# EasyEDA Pro project LY-5X-V3.1 - (0905).eprj, schematic 4轴-原理图-V01
Board Name: 4轴PCB; Create Date: 2024-07-26; Page Name: 4轴-原理图-V01; Project Name: LY-5X-V3.1 - (0905); Schematic Name: 4轴-原理图-V01; Update Date: 2025-12-03; Address1: *; Address2: *; Address3: *; Address4: *; ApprovedBy: *; Author: *; CheckedBy: *; CompanyName: *; CurrentDate: *; CurrentTime: *; Date: *; DocumentFullPathAndName: *; DocumentName: *; DocumentNumber: *; DrawnBy: *; Engineer: *; ImagePath: *; ModifiedDate: *; Organization: *; ProjectName: *; Revision: *; Rule: *; SheetNumber: *; SheetTotal: *; Time: *; Title: *
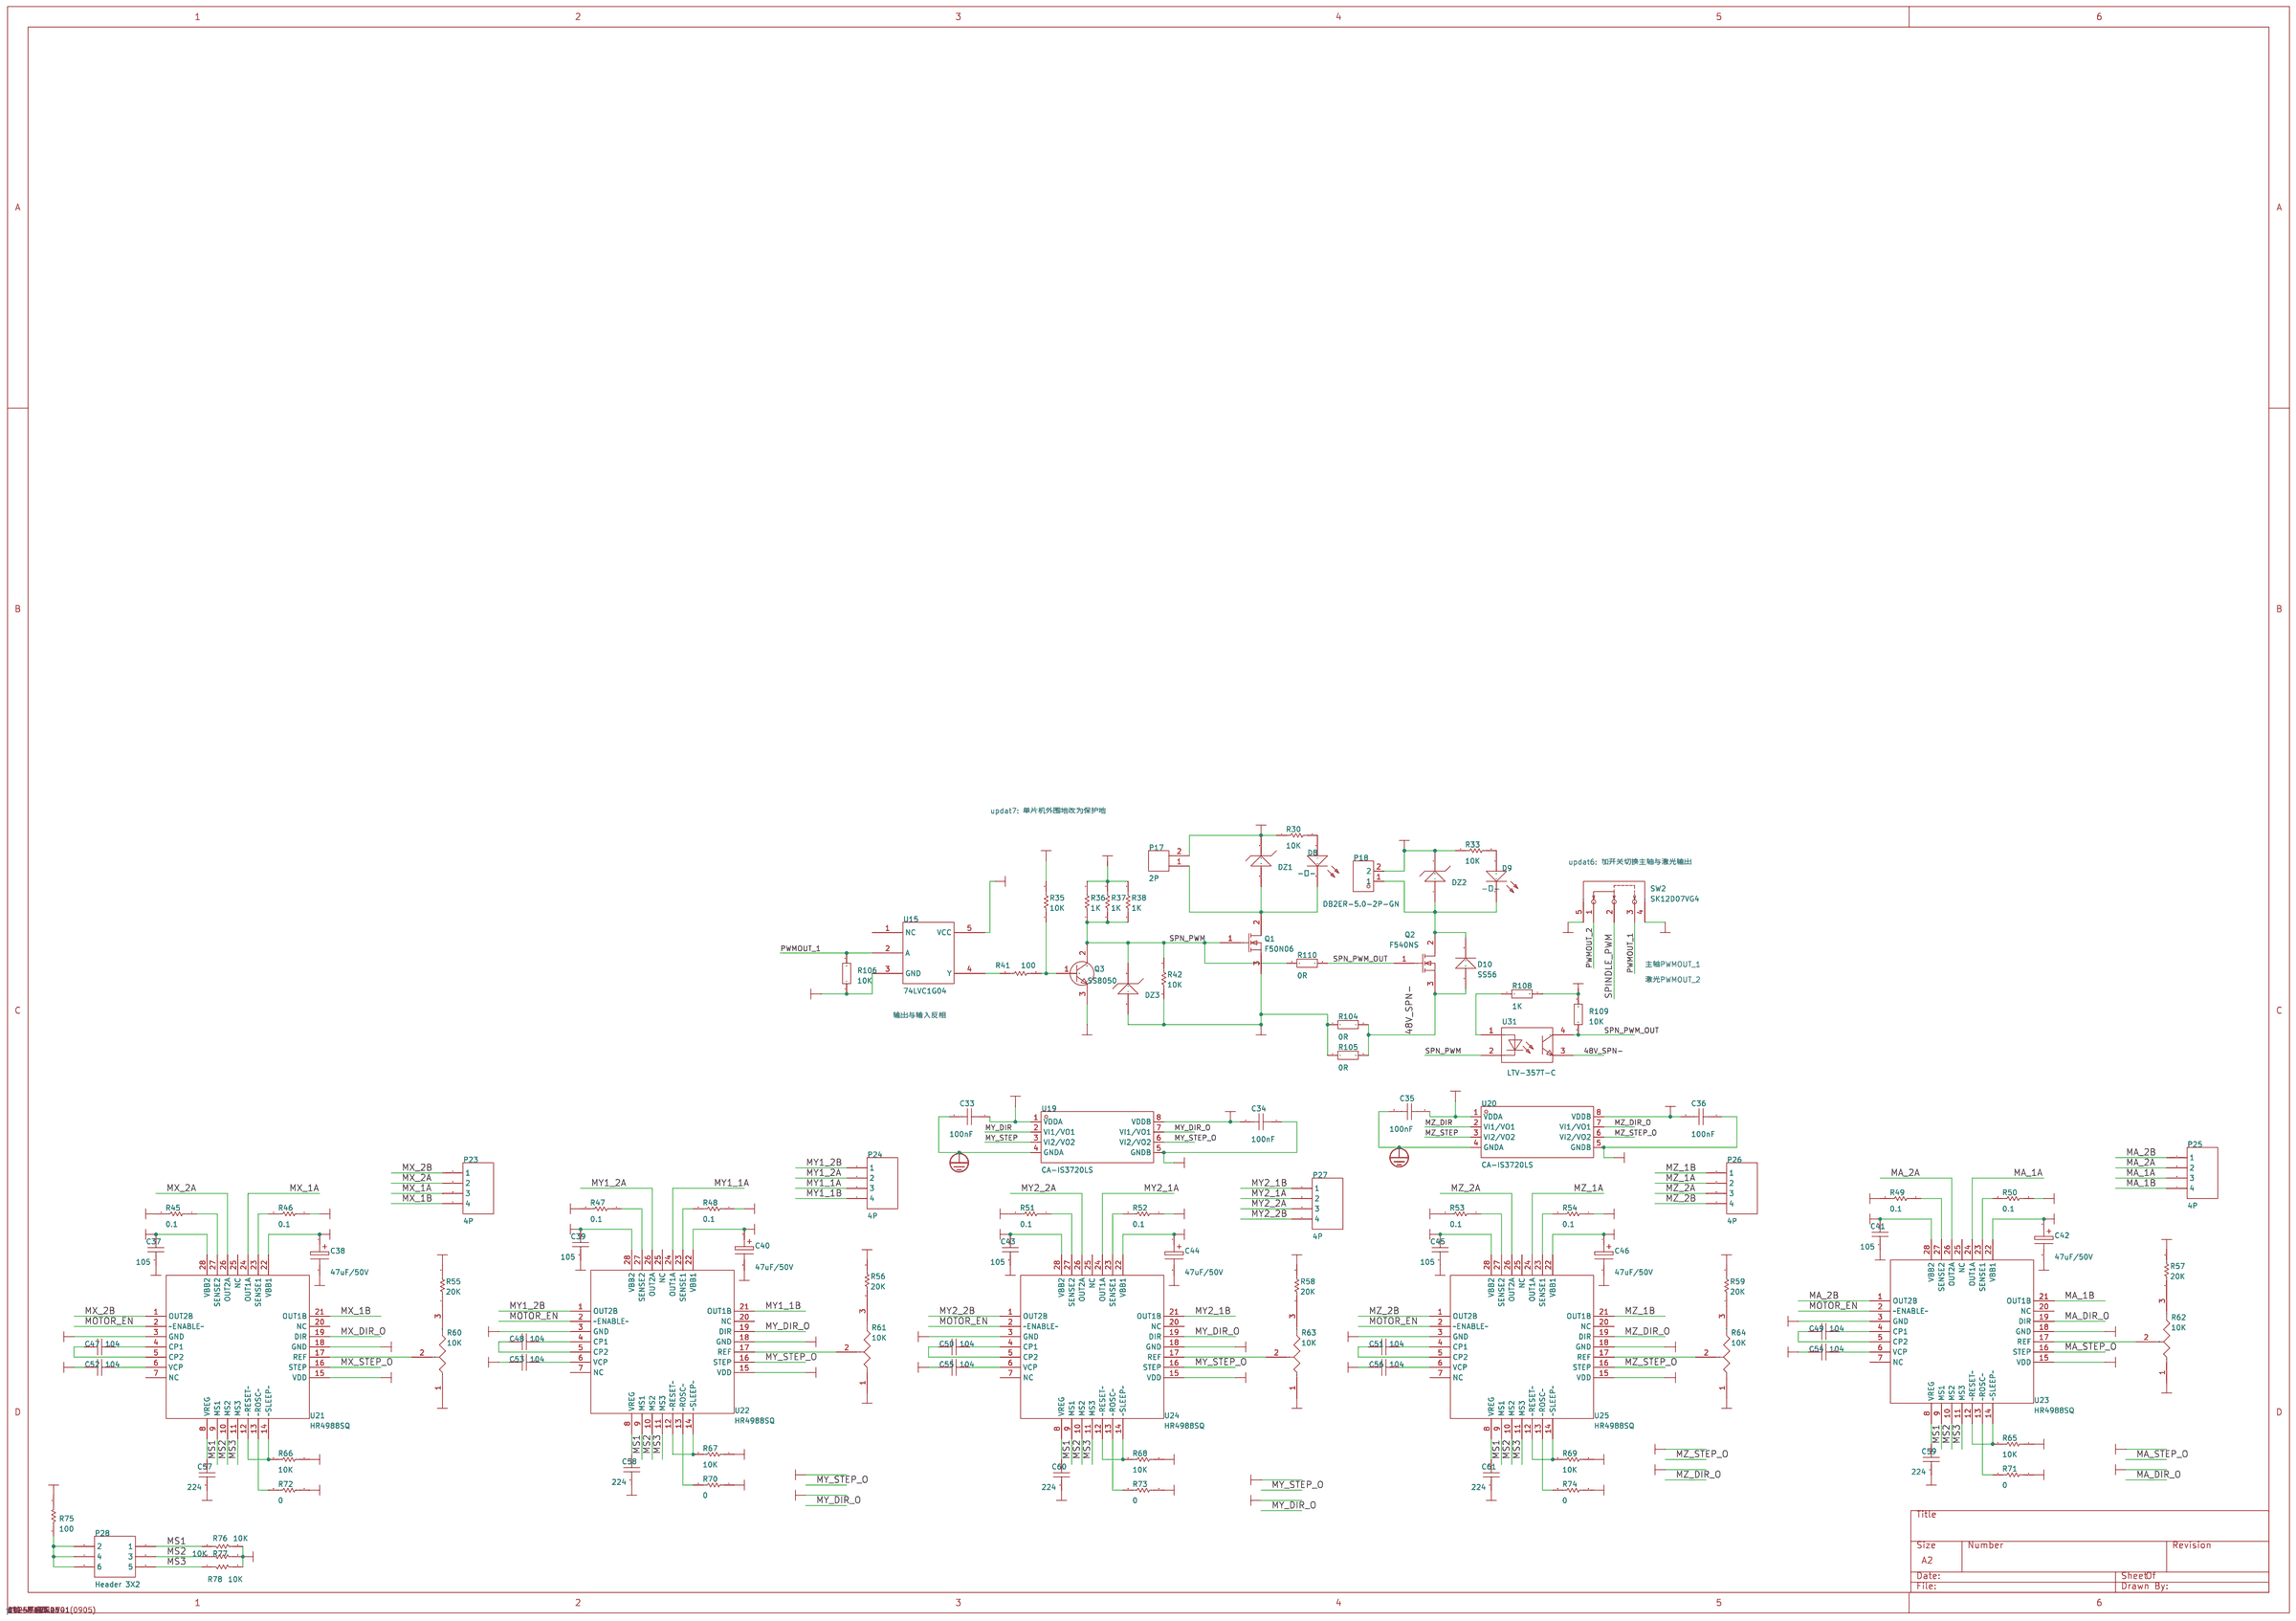
[diagram p0: schematic sheet]

## Parts
C33  100nF  [C0603]
C34  100nF  [C0603]
C35  100nF  [C0603]
C36  100nF  [C0603]
C37  105  [0805C]
C38  47uF/50V  [电解电容贴片6x6]
C39  105  [0805C]
C40  47uF/50V  [电解电容贴片6x6]
C41  105  [0805C]
C42  47uF/50V  [电解电容贴片6x6]
C43  105  [0805C]
C44  47uF/50V  [电解电容贴片6x6]
C45  105  [0805C]
C46  47uF/50V  [电解电容贴片6x6]
C47  104  [C0603]
C48  104  [C0603]
C49  104  [C0603]
C50  104  [C0603]
C51  104  [C0603]
C52  104  [C0603]
C53  104  [C0603]
C54  104  [C0603]
C55  104  [C0603]
C56  104  [C0603]
C57  224  [C0603]
C58  224  [C0603]
C59  224  [C0603]
C60  224  [C0603]
C61  224  [C0603]
D8  -̹-  [0603LED]
D9  -̹-  [0603LED]
D10  SS56  [SMA]
DZ1  --ָ-------RS2M  [SMC]
DZ2  --ָ-------RS2M  [SMC]
DZ3  --ѹ------SMAZ10V  [SMA]
P17  2P  [CONN-TH_2P-P5.00_DB2ER-5.0-2P-GN]
P18  DB2ER-5.0-2P-GN  [CONN-TH_2P-P5.00_DB2ER-5.0-2P-GN]
P23  4P  [HDR1X4_CON]
P24  4P  [HDR1X4_CON]
P25  4P  [HDR1X4_CON]
P26  4P  [HDR1X4_CON]
P27  4P  [HDR1X4_CON]
P28  Header 3X2  [HDR2X3]
Q1  F50N06  [TO-252]
Q2  F540NS  [TO-263-2]
Q3  SS8050  [SOT-23]
R30  10K  [0603R]
R33  10K  [0603R]
R35  10K  [0603R]
R36  1K  [0603R]
R37  1K  [0603R]
R38  1K  [0603R]
R41  100  [0603R]
R42  10K  [0603R]
R45  0.1  [0805R]
R46  0.1  [0805R]
R47  0.1  [0805R]
R48  0.1  [0805R]
R49  0.1  [0805R]
R50  0.1  [0805R]
R51  0.1  [0805R]
R52  0.1  [0805R]
R53  0.1  [0805R]
R54  0.1  [0805R]
R55  20K  [0603R]
R56  20K  [0603R]
R57  20K  [0603R]
R58  20K  [0603R]
R59  20K  [0603R]
R60  10K  [松下贴片电位器3x3]
R61  10K  [松下贴片电位器3x3]
R62  10K  [松下贴片电位器3x3]
R63  10K  [松下贴片电位器3x3]
R64  10K  [松下贴片电位器3x3]
R65  10K  [0603R]
R66  10K  [0603R]
R67  10K  [0603R]
R68  10K  [0603R]
R69  10K  [0603R]
R70  0  [0603R]
R71  0  [0603R]
R72  0  [0603R]
R73  0  [0603R]
R74  0  [0603R]
R75  100  [0603R]
R76  10K  [0603R]
R77  10K  [0603R]
R78  10K  [0603R]
R104  0R  [R1210]
R105  0R  [R1210]
R106  10K  [R0603]
R108  1K  [R0603]
R109  10K  [R0603]
R110  0R  [R0603]
SW2  SK12D07VG4  [SW-TH_SK12D07VG4]
U15  74LVC1G04  [SOT-23-5]
U19  CA-IS3720LS  [SOIC-8_L4.9-W3.9-P1.27-LS6.0-BL]
U20  CA-IS3720LS  [SOIC-8_L4.9-W3.9-P1.27-LS6.0-BL]
U21  HR4988SQ  [QFN28]
U22  HR4988SQ  [QFN28]
U23  HR4988SQ  [QFN28]
U24  HR4988SQ  [QFN28]
U25  HR4988SQ  [QFN28]
U31  LTV-357T-C  [SOP-4_L4.4-W3.9-P2.54-LS7.0-TL]

## Library data of the parts
C33-C36 = CAP_0603: Supplier Footprint: 0603
C37 C39 C41 C43 C45 = 105: Design Item ID: CAP; Library Name: SCH--װ--
C38 C40 C42 C44 C46 = 47uF/50V: Origin Footprint 2: X47U; Origin Footprint 1: ________Ƭ6x6; Design Item ID: ELECTRO1; Library Name: *
C47-C56 = 104: Design Item ID: CAP; Library Name: SCH--װ--
C57-C61 = 224: Design Item ID: CAP; Library Name: SCH--װ--
D8 D9 = �̹�: Origin Footprint 2: LED(С); Design Item ID: LED; Library Name: SCH--װ--
D10 = SS56: Design Item ID: 1N4148; Library Name: SCH--װ--
DZ1 DZ2 = ��ָ�������RS2M: Design Item ID: --ѹ------; Library Name: SCH--װ--
DZ3 = ��ѹ������SMAZ10V: Design Item ID: --ѹ------; Library Name: SCH--װ--
P17 = 2P: Library Name: SCH--װ--
P18 = DB2ER-5.0-2P-GN: 间距:5mm;颜色:绿色;排数:1;每排PIN数:2;额定电流:15A;额定电压:630V;触头镀层:锡;; LCSC Part Name: 5mm排数:1每排P数:2; Supplier Part: C5454428; Manufacturer: DORABO(地博电气); Supplier Footprint: P=5mm; JLCPCB Part Class: 扩展库; Datasheet: https://atta.szlcsc.com/upload/public/pdf/source/20230427/39CC0BD2D36F5E0FC60100946C6C8B3A.pdf; Supplier: LCSC; Pitch: 5mm; Color: 绿色; Number of Pins: 2P; Number of Rows: 1; Number of PINs Per Row: 2; Current Rating (Max): 15A; Voltage Rating (Max): 630V; Contact Plating: 锡
P23-P27 = 4P: Library Name: SCH--װ--
P28 = Header 3X2: Header, 3-Pin, Dual row; LatestRevisionDate: 17-Jul-2002; LatestRevisionNote: Re-released for DXP Platform.; Publisher: Altium Limited; Library Name: Miscellaneous Connectors
Q1 = F50N06: N-Channel MOSFET; Published: 8-Jun-2000; LatestRevisionDate: 17-Jul-2002; LatestRevisionNote: Re-released for DXP Platform.; PackageVersion: 1995/1996; PackageReference: E3; Publisher: Altium Limited; Design Item ID: MOSFET-N; Library Name: SCH--װ--
Q2 = F540NS: N-Channel MOSFET; Published: 8-Jun-2000; LatestRevisionDate: 17-Jul-2002; LatestRevisionNote: Re-released for DXP Platform.; PackageVersion: 1995/1996; PackageReference: E3; Publisher: Altium Limited; Design Item ID: MOSFET-N; Library Name: SCH--װ--
Q3 = SS8050: Published: 8-Jun-2000; LatestRevisionDate: 17-Jul-2002; LatestRevisionNote: Re-released for DXP Platform.; PackageReference: TO-226; Publisher: Altium Limited; Code_JEDEC: TO-226-AA; Origin Footprint 2: TO-92; Design Item ID: NPN; Library Name: SCH--װ--
R30 R33 R35 R42 R65-R69 R76-R78 = 10K: Resistor; Published: 8-Jun-2000; LatestRevisionDate: 17-Jul-2002; LatestRevisionNote: Re-released for DXP Platform.; PackageReference: AXIAL-0.3; Publisher: Altium Limited; Origin Footprint 2: AXIAL-0.3; Origin Footprint 3: R0805; Origin Footprint 4: 0805R; Design Item ID: RES; Library Name: SCH--װ--
R36-R38 = 1K: Resistor; Published: 8-Jun-2000; LatestRevisionDate: 17-Jul-2002; LatestRevisionNote: Re-released for DXP Platform.; PackageReference: AXIAL-0.3; Publisher: Altium Limited; Origin Footprint 2: AXIAL-0.3; Origin Footprint 3: R0805; Origin Footprint 4: 0805R; Design Item ID: RES; Library Name: SCH--װ--
R41 R75 = 100: Resistor; Published: 8-Jun-2000; LatestRevisionDate: 17-Jul-2002; LatestRevisionNote: Re-released for DXP Platform.; PackageReference: AXIAL-0.3; Publisher: Altium Limited; Origin Footprint 2: AXIAL-0.3; Origin Footprint 3: R0805; Origin Footprint 4: 0805R; Design Item ID: RES; Library Name: SCH--װ--
R45-R54 = 0.1: Resistor; Published: 8-Jun-2000; LatestRevisionDate: 17-Jul-2002; LatestRevisionNote: Re-released for DXP Platform.; PackageReference: AXIAL-0.3; Publisher: Altium Limited; Origin Footprint 2: AXIAL-0.3; Origin Footprint 3: R0805; Origin Footprint 4: 0603R; Design Item ID: RES; Library Name: SCH--װ--
R55-R59 = 20K: Resistor; Published: 8-Jun-2000; LatestRevisionDate: 17-Jul-2002; LatestRevisionNote: Re-released for DXP Platform.; PackageReference: AXIAL-0.3; Publisher: Altium Limited; Origin Footprint 2: AXIAL-0.3; Origin Footprint 3: R0805; Origin Footprint 4: 0805R; Design Item ID: RES; Library Name: SCH--װ--
R60-R64 = 10K: Design Item ID: --λ--; Library Name: SCH--װ--
R70-R74 = 0: Resistor; Published: 8-Jun-2000; LatestRevisionDate: 17-Jul-2002; LatestRevisionNote: Re-released for DXP Platform.; PackageReference: AXIAL-0.3; Publisher: Altium Limited; Origin Footprint 2: AXIAL-0.3; Origin Footprint 3: R0805; Origin Footprint 4: 0805R; Design Item ID: RES; Library Name: SCH--װ--
R104 R105 = Res_1210: Supplier Footprint: 1210
R106 R108-R110 = Res_0603: Supplier Footprint: 0603
SW2 = SK12D07VG4: 电路结构:单刀双掷;安装方式:侧插;额定电流(DC):500mA;额定电压(DC):50V;额定电流(AC):-;额定电压(AC):-;机械寿命:5千次;; LCSC Part Name: 3脚2档位卧插滑动开关; Supplier Part: C393937; Manufacturer: SHOUHAN(首韩); Supplier Footprint: 插件; JLCPCB Part Class: 扩展库; Datasheet: https://atta.szlcsc.com/upload/public/pdf/source/20190521/C393937_939FE26E571CC67D2D532E953108A1B0.pdf; Supplier: LCSC; Circuit: 单刀双掷; Actuator Style: 矩形柱状; Pin Style: PC引脚; Switch Height: 8.8mm; Mounting Style: 侧插; Current Rating (DC): 500mA; Voltage Rating (DC): 50V; Mechanical Life: 5千次
U15 = 74LVC1G04: Design Item ID: 74LVC1G17; Library Name: SCH--װ--
U19 U20 = CA-IS3720LS: LCSC Part Name: CA-IS372x高速双通道数字隔离器; Supplier Part: C5121215; Manufacturer: Chipanalog(川土微); Supplier Footprint: SOIC-8; JLCPCB Part Class: 扩展库; Datasheet: https://atta.szlcsc.com/upload/public/pdf/source/20220817/B10411DCED9A45C0160465FE161A7C01.pdf; Supplier: LCSC
U21-U25 = HR4988SQ: Design Item ID: HR4988; Library Name: SCH--װ--
U31 = LTV-357T-C: 输入电压类型:DC;正向电压:1.2V;输出电流:50mA;隔离电压(rms):3.75kV;反向电压:6V;接收端电压:35V;输出通道数:1;集射极饱和电压(Vce(sat)@Ic,IF):200mV@1mA,20mA;; LCSC Part Name: DC输入隔离电压(rms):3750V; Supplier Part: C119091; Manufacturer: LITEON(光宝); Supplier Footprint: SOP-4-2.54mm; JLCPCB Part Class: 扩展库; Datasheet: https://atta.szlcsc.com/upload/public/pdf/source/20170930/C133128_1506736380934997376.pdf; Supplier: LCSC; Input voltage type: DC; Output Type: 光电三极管; Forward Voltage: 1.2V; Output Current: 50mA; Isolation Voltage(rms): 3.75kV; Reverse Voltage: 6V; Receiving End Voltage: 35V; Number of Outputs: 1; Collector-Emitter Saturation Voltage (Vce(sat)@Ic,IF): 200mV@1mA,20mA; Rise time: 4us@2mA,100Ω; Fall time: 3us@2mA,100Ω; Operating Temperature: -55℃~+110℃

## Nets
3V3: C33.1 C35.1 U19.1(VDDA) U20.1(VDDA)
12V: R36.2 R37.2 R38.2 R108.2 R109.2
24V: C37.1 C38.1 C39.1 C40.1 C41.1 C42.1 C43.1 C44.1 C45.1 C46.1 C52.2 C53.2 C54.2 C55.2 C56.2 DZ1.2 P17.2 R30.1 U21.22(VBB1) U21.28(VBB2) U22.22(VBB1) U22.28(VBB2) U23.22(VBB1) U23.28(VBB2) U24.22(VBB1) U24.28(VBB2) U25.22(VBB1) U25.28(VBB2)
48V_SPN-: D10.1 Q2.3(S) R104.2 R105.2 U31.3
GND: C34.1 C36.1 C37.2 C38.2 C39.2 C40.2 C41.2 C42.2 C43.2 C44.2 C45.2 C46.2 C57.2 C58.2 C59.2 C60.2 C61.2 DZ3.1 Q1.3(S) Q3.3(E) R42.2 R45.2 R46.1 R47.2 R48.1 R49.2 R50.1 R51.2 R52.1 R53.2 R54.1 R60.1(A) R61.1(A) R62.1(A) R63.1(A) R64.1(A) R70.1 R71.1 R72.1 R73.1 R74.1 R76.2 R77.2 R78.2 R104.1 R105.1 R106.1 SW2.4 SW2.5 U15.3(GND) U19.5(GNDB) U20.5(GNDB) U21.3(GND) U21.18(GND) U22.3(GND) U22.18(GND) U23.3(GND) U23.18(GND) U24.3(GND) U24.18(GND) U25.3(GND) U25.18(GND)
PGND: C33.2 C35.2 U19.4(GNDA) U20.4(GNDA)
VCC: C34.2 C36.2 R35.2 R55.2 R56.2 R57.2 R58.2 R59.2 R65.1 R66.1 R67.1 R68.1 R69.1 R75.1 U15.5(VCC) U19.8(VDDB) U20.8(VDDB) U21.15(VDD) U22.15(VDD) U23.15(VDD) U24.15(VDD) U25.15(VDD)
MA_1A: P25.3 U23.24(OUT1A)
MA_1B: P25.4 U23.21(OUT1B)
MA_2A: P25.2 U23.26(OUT2A)
MA_2B: P25.1 U23.1(OUT2B)
MA_DIR_O: U23.19(DIR)
MA_STEP_O: U23.16(STEP)
MOTOR_EN: U21.2(~ENABLE~) U22.2(~ENABLE~) U23.2(~ENABLE~) U24.2(~ENABLE~) U25.2(~ENABLE~)
MS1: P28.1 R76.1 U21.9(MS1) U22.9(MS1) U23.9(MS1) U24.9(MS1) U25.9(MS1)
MS2: P28.3 R77.1 U21.10(MS2) U22.10(MS2) U23.10(MS2) U24.10(MS2) U25.10(MS2)
MS3: P28.5 R78.1 U21.11(MS3) U22.11(MS3) U23.11(MS3) U24.11(MS3) U25.11(MS3)
MX_1A: P23.3 U21.24(OUT1A)
MX_1B: P23.4 U21.21(OUT1B)
MX_2A: P23.2 U21.26(OUT2A)
MX_2B: P23.1 U21.1(OUT2B)
MX_DIR_O: U21.19(DIR)
MX_STEP_O: U21.16(STEP)
MY1_1A: P24.3 U22.24(OUT1A)
MY1_1B: P24.4 U22.21(OUT1B)
MY1_2A: P24.2 U22.26(OUT2A)
MY1_2B: P24.1 U22.1(OUT2B)
MY2_1A: P27.2 U24.24(OUT1A)
MY2_1B: P27.1 U24.21(OUT1B)
MY2_2A: P27.3 U24.26(OUT2A)
MY2_2B: P27.4 U24.1(OUT2B)
MY_DIR: U19.2(VI1/VO1)
MY_DIR_O: U19.7(VI1/VO1) U22.19(DIR) U24.19(DIR)
MY_STEP: U19.3(VI2/VO2)
MY_STEP_O: U19.6(VI2/VO2) U22.16(STEP) U24.16(STEP)
MZ_1A: P26.2 U25.24(OUT1A)
MZ_1B: P26.1 U25.21(OUT1B)
MZ_2A: P26.3 U25.26(OUT2A)
MZ_2B: P26.4 U25.1(OUT2B)
MZ_DIR: U20.2(VI1/VO1)
MZ_DIR_O: U20.7(VI1/VO1) U25.19(DIR)
MZ_STEP: U20.3(VI2/VO2)
MZ_STEP_O: U20.6(VI2/VO2) U25.16(STEP)
PWMOUT_1: R106.2 SW2.3 U15.2(A)
PWMOUT_2: SW2.1
SPINDLE_PWM: SW2.2
SPN+: DZ2.2 P18.2 R33.1
SPN_PWM: DZ3.2 Q1.1(G) Q3.2(C) R36.1 R37.1 R38.1 R42.1 R110.1 U31.2
SPN_PWM_OUT: Q2.1(G) R109.1 R110.2 U31.4
$1N312: C47.2 U21.5(CP2)
$1N313: C47.1 U21.4(CP1)
$1N314: C52.1 U21.6(VCP)
$1N330: C57.1 U21.8(VREG)
$1N353: R66.2 U21.12(~RESET~) U21.14(~SLEEP~)
$1N397: R60.2(TAP) U21.17(REF)
$1N462: R46.2 U21.23(SENSE1)
$1N491: R45.1 U21.27(SENSE2)
$1N562: C48.2 U22.5(CP2)
$1N563: C48.1 U22.4(CP1)
$1N564: C53.1 U22.6(VCP)
$1N580: C58.1 U22.8(VREG)
$1N603: R67.2 U22.12(~RESET~) U22.14(~SLEEP~)
$1N647: R61.2(TAP) U22.17(REF)
$1N712: R48.2 U22.23(SENSE1)
$1N741: R47.1 U22.27(SENSE2)
$1N812: C50.2 U24.5(CP2)
$1N813: C50.1 U24.4(CP1)
$1N814: C55.1 U24.6(VCP)
$1N830: C60.1 U24.8(VREG)
$1N853: R68.2 U24.12(~RESET~) U24.14(~SLEEP~)
$1N897: R63.2(TAP) U24.17(REF)
$1N962: R52.2 U24.23(SENSE1)
$1N991: R51.1 U24.27(SENSE2)
$1N1062: C51.2 U25.5(CP2)
$1N1063: C51.1 U25.4(CP1)
$1N1064: C56.1 U25.6(VCP)
$1N1080: C61.1 U25.8(VREG)
$1N1103: R69.2 U25.12(~RESET~) U25.14(~SLEEP~)
$1N1147: R64.2(TAP) U25.17(REF)
$1N1212: R54.2 U25.23(SENSE1)
$1N1241: R53.1 U25.27(SENSE2)
$1N2042: D9.2 D10.2 DZ2.1 P18.1 Q2.2(D)
$1N2146: D8.2 DZ1.1 P17.1 Q1.2(D)
$1N2614: P28.2 P28.4 P28.6 R75.2
$1N3462: R72.2 U21.13(~ROSC~)
$1N3499: R70.2 U22.13(~ROSC~)
$1N3500: R73.2 U24.13(~ROSC~)
$1N3519: R74.2 U25.13(~ROSC~)
$1N3756: R41.1 U15.4(Y)
$1N3757: Q3.1(B) R35.1 R41.2
$1N4012: R55.1 R60.3(B)
$1N4029: R56.1 R61.3(B)
$1N4046: R58.1 R63.3(B)
$1N4065: R59.1 R64.3(B)
$1N4086: D8.1 R30.2
$1N4090: D9.1 R33.2
$1N11258: C49.2 U23.5(CP2)
$1N11262: C49.1 U23.4(CP1)
$1N11264: C54.1 U23.6(VCP)
$1N11268: C59.1 U23.8(VREG)
$1N11270: R65.2 U23.12(~RESET~) U23.14(~SLEEP~)
$1N11280: R62.2(TAP) U23.17(REF)
$1N11295: R50.2 U23.23(SENSE1)
$1N11308: R49.1 U23.27(SENSE2)
$1N11356: R71.2 U23.13(~ROSC~)
$1N11367: R57.1 R62.3(B)
$1N53890: R108.1 U31.1

Not connected (* = marked no-connect by the designer): U15 1(NC); U21 7(NC) 20(NC) 25(NC); U22 7(NC) 20(NC) 25(NC); U23 7(NC) 20(NC) 25(NC); U24 7(NC) 20(NC) 25(NC); U25 7(NC) 20(NC) 25(NC)

## Notes on the sheet
- updat7: 单片机外围地改为保护地
- updat6: 加开关切换主轴与激光输出
- 主轴PWMOUT_1
- 激光PWMOUT_2
- 输出与输入反相
